# EAGLE design attiny85-ws2812b-v1 (EAGLE 8.6.3)
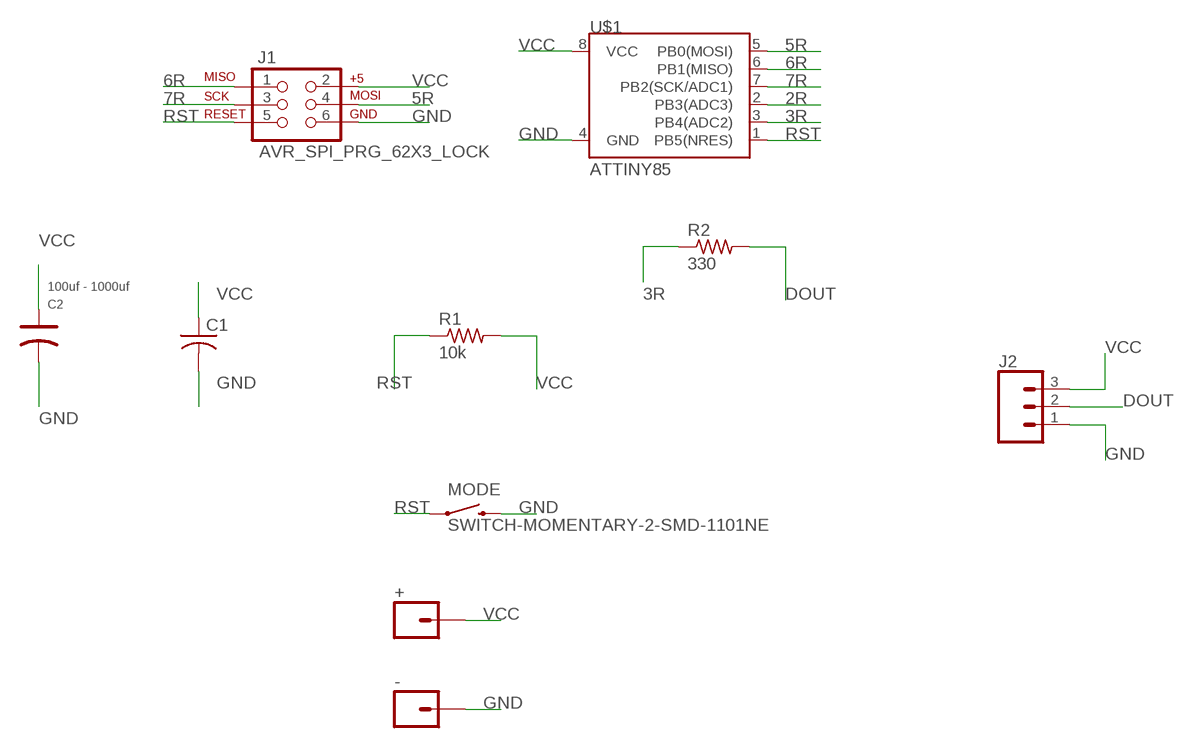
[diagram p0: schematic, sheet 1]

## Parts
+  CONN_01PTH_LONGPAD  [1X01_LONGPAD]
-  CONN_01PTH_LONGPAD  [1X01_LONGPAD]
C1  C-USC0805K  [C0805K]
C2  100uf - 1000uf  DIP-ALUMINUM-100UF-16V(D5-H7MM)  [PC-D5.3MM]
J1  AVR_SPI_PRG_62X3_LOCK  [2X3_LOCK]
J2  CONN_03LOCK_LONGPADS  [1X03_LOCK_LONGPADS]
MODE  SWITCH-MOMENTARY-2-SMD-1101NE  [TACTILE-SWITCH-1101NE]
R1  10k  R-US_M0805  [M0805]
R2  330  R-US_M0805  [M0805]
U$1  ATTINY85  ATTINY45  [SO08-EIAJ]

## Nets
2R: U$1.2(PB3(ADC3))
3R: R2.1 U$1.3(PB4(ADC2))
5R: J1.4 U$1.5(PB0(MOSI))
6R: J1.1 U$1.6(PB1(MISO))
7R: J1.3 U$1.7(PB2(SCK/ADC1))
DOUT: J2.2 R2.2
GND: -.1 C1.2 C2.- J1.6 J2.1 MODE.P$2 U$1.4(GND)
RST: J1.5 MODE.P$1 R1.1 U$1.1(PB5(NRES))
VCC: +.1 C1.1 C2.+ J1.2 J2.3 R1.2 U$1.8(VCC)

## Library data of the parts
+ - = SparkFun-Connectors:CONN_01: Single connection point. Often used as Generic Header-pin footprint for 0.1 inch spaced/style header connections On any of the 0.1 inch spaced packages, you can populate with these: Break Away Headers - Straight <https://www.sparkfun.com/products/116> (PRT-00116) Break Away Male Headers - Right Angle <https://www.sparkfun.com/products/553> (PRT-00553) Female Headers <https://www.sparkfun.com/products/115> (PRT-00115) Break Away Headers - Machine Pin <https://www.sparkfun.com/products/117> (PRT-00117) Break Away Female Headers - Swiss Machine Pin <https://www.sparkfun.com/products/743> (PRT-00743) This device is also useful as a general connection point to wire up your design to another part of your project. Our various solder wires solder well into these plated through hole pads. Hook-Up Wire - Assortment (Stranded, 22 AWG) <https://www.sparkfun.com/products/11375> (PRT-11375) Hook-Up Wire - Assortment (Solid Core, 22 AWG) <https://www.sparkfun.com/products/11367> (PRT-11367) View the entire wire category on our website here <https://www.sparkfun.com/categories/141> Special notes: SMTSO-256-ET is a "flush mount" nut for a 4-40 screw. We mostly use this on specialty testbeds; it is a nice way to connect hardware to your PCB at an adjustable hieght. Also note, the SNAP packages are for using a snappable style connector. We sell a baggie of snaps and they are also used on two LilyPad designs: Snap Assortment - 30 pack (male and female) <https://www.sparkfun.com/products/11347> (DEV-11347) LilyPad Arduino SimpleSnap <https://www.sparkfun.com/products/10941> (DEV-10941) LilyPad SimpleSnap Protoboard <https://www.sparkfun.com/products/10940> (DEV-10940)
C1 = adafruit:C-US: CAPACITOR, American symbol
C2 = Seeed-Capacitor:DIP-ALUMINUM-100UF-16V(D5-H7MM): 302030031; MPN: KS 100uF/16V; VALUE: 100uf
J1 = SparkFun-Connectors:AVR_SPI_PRG_6: AVR ISP 6 Pin This is the reduced ISP connector for AVR programming. Common on Arduino. This footprint will take up less PCB space and can be used with a 10-pin to 6-pin adapter such as SKU: BOB-08508
J2 = SparkFun-Connectors:CONN_03: Multi connection point. Often used as Generic Header-pin footprint for 0.1 inch spaced/style header connections On any of the 0.1 inch spaced packages, you can populate with these: Break Away Headers - Straight <https://www.sparkfun.com/products/116> (PRT-00116) Break Away Male Headers - Right Angle <https://www.sparkfun.com/products/553> (PRT-00553) Female Headers <https://www.sparkfun.com/products/115> (PRT-00115) Break Away Headers - Machine Pin <https://www.sparkfun.com/products/117> (PRT-00117) Break Away Female Headers - Swiss Machine Pin <https://www.sparkfun.com/products/743> (PRT-00743) Stackable Header - 3 Pin (Female, 0.1") <https://www.sparkfun.com/products/13875> (PRT-13875) For SCREWTERMINALS and SPRING TERMINALS visit here: Screw Terimnals on SparkFun.com <https://www.sparkfun.com/search/results?term=Screw+Terminals> (5mm/3.5mm/2.54mm spacing) This device is also useful as a general connection point to wire up your design to another part of your project. Our various solder wires solder well into these plated through hole pads. Hook-Up Wire - Assortment (Stranded, 22 AWG) <https://www.sparkfun.com/products/11375> (PRT-11375) Hook-Up Wire - Assortment (Solid Core, 22 AWG) <https://www.sparkfun.com/products/11367> (PRT-11367) View the entire wire category on our website here <https://www.sparkfun.com/categories/141> Special notes: Molex polarized connector foot print use with SKU : PRT-08232 with associated crimp pins and housings.
MODE = SparkFun-Electromechanical:SWITCH-MOMENTARY-2: Various NO switches- pushbuttons, reed, etc
R1 R2 = adafruit:R-US_: RESISTOR, American symbol
U$1 = SparkFun:ATTINY45: Atmel ATTiny45

## Board
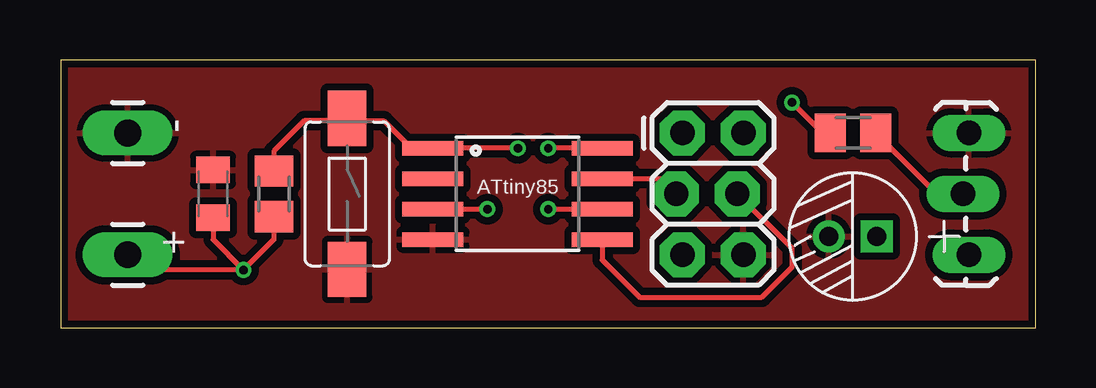
[diagram p1: board, top side]
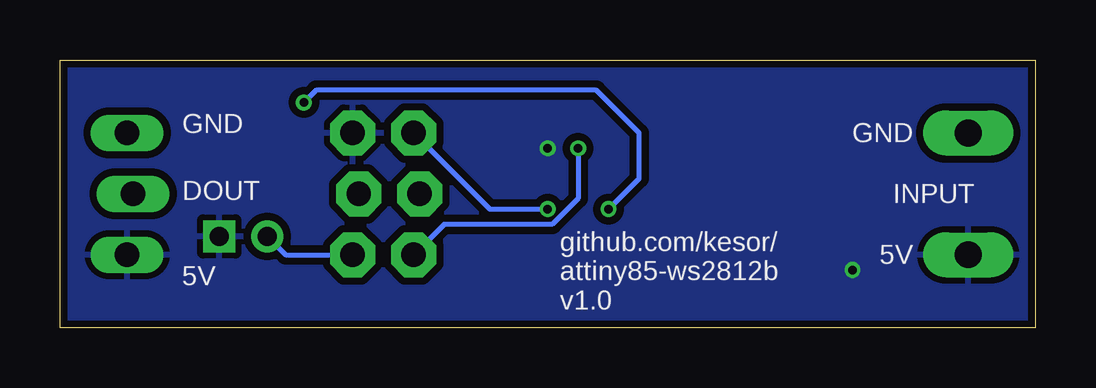
[diagram p2: board, bottom side, seen from below]

Size 40.64 x 11.18 mm. Coordinates in mm from the lower left corner, seen from the top.
Outline: 0,11.18 0,0 40.64,0 40.64,11.18 0,11.18
Copper layers (1*16): Top 0.035mm / dielectric 1.5mm / Bottom 0.035mm
Design rules "Fusion_eagle_rule_v1.1 *": minimum track width 8mil, minimum drill 12mil, track to track 6mil, track to pad 6mil, pad to pad 6mil, via to via 6mil, smd to smd 0mil, copper to edge 10mil, drill to drill 10mil, minimum pad ring 10mil, minimum via ring 6mil, stop-mask expansion 2mil, vias tented up to drill 100mil, thermal gap 10mil

### Footprints (pad centres in the part's own frame; a part is rotated, then mirrored left to right if it is on the bottom)
1X01_LONGPAD = drill 1.118 pad 1.88 long: 1 0,0
C0805K = smd 1.1 x 1.4: 1 -1,0; 2 1,0
PC-D5.3MM = drill 0.8 pad 1.35 square: + -1,0 | drill 0.8 pad 1.35: - 1,0
2X3_LOCK = drill 1.016 pad 1.88 octagon: 1 0,0; 2 0,2.54; 3 2.54,-0.254; 4 2.54,2.286; 5 5.08,0; 6 5.08,2.54
1X03_LOCK_LONGPADS = drill 1.016 long: 1 0,0; 2 2.54,-0.254; 3 5.08,0
TACTILE-SWITCH-1101NE = smd 2.3 x 1.6: P$1 -3.15,0; P$2 3.15,0
M0805 = smd 1.3 x 1.6: 1 -0.95,0; 2 0.95,0
SO08-EIAJ = smd 0.61 x 2.54: 1 -1.905,-3.543; 2 -0.635,-3.543; 3 0.635,-3.543; 4 1.905,-3.543; 5 1.905,3.518; 6 0.635,3.518; 7 -0.635,3.518; 8 -1.905,3.518

### Placement (x,y rotation side)
+  2.79,3.05 90 top
-  2.79,8.13 90 top
C1  6.35,5.59 90 top
C2  33,3.81 180 top
J1  25.91,8.13 270 top
J2  37.85,8.13 270 top
MODE  11.94,5.59 270 top
R1  8.89,5.59 270 top
R2  33.02,8.13 0 top
U$1  19.05,5.59 270 top

### Tracks (layer width: path | path; a pad name or v marks a point on that pad's centre or on a via)
3R  (via drill 0.35)
  Top 0.203: U$1.3 v17.78,4.95 | v30.48,9.4 31.75,8.13 R2.1
  Bottom 0.203: v17.78,4.95 16.51,6.22 16.51,8.13 18.29,9.91 29.97,9.91 v30.48,9.4
5R
  Top 0.203: U$1.5 22.57,2.83 24.13,1.27 29.21,1.27 30.48,2.54 30.48,3.3 J1.4
6R  (via drill 0.35)
  Top 0.203: v20.32,4.95 U$1.6
  Bottom 0.203: J1.1 22.73,4.95 v20.32,4.95
7R
  Top 0.203: U$1.7 25.02,6.22 J1.3
DOUT
  Top 0.203: R2.2 36.51,5.59 J2.2
GND
  Bottom 0.203: C2.- 31.24,3.05 J1.6
  pour Top (isolate 0.305, rank 6): 0,0 0,11.18 40.64,11.18 40.64,0
RST  (via drill 0.35)
  Top 0.203: 8.89,6.6 R1.1 8.89,7.37 10.16,8.64 11.94,8.64 | v19.05,7.49 U$1.1 14.6,7.49 13.46,8.64 11.94,8.64 | MODE.P$1 11.94,8.64
  Bottom 0.203: J1.5 24.64,4.32 20.13,4.32 19.05,5.4 v19.05,7.49
VCC  (via drill 0.35)
  Top 0.203: U$1.8 v20.32,7.49 | C1.1 6.35,3.68 v7.62,2.41 | R1.2 8.89,3.68 v7.62,2.41 | v7.62,2.41 3.43,2.41 +.1
  pour Bottom (isolate 0.305, rank 6): 0,0 0,11.18 40.64,11.18 40.64,0

### Text on the board
tPlace: ATtiny85
bPlace: GND | GND | INPUT | DOUT | 5V | 5V | github.com/kesor/ / attiny85-ws2812b / v1.0